# EAGLE schematic Esquemático_v4 (EAGLE 9.7.0)
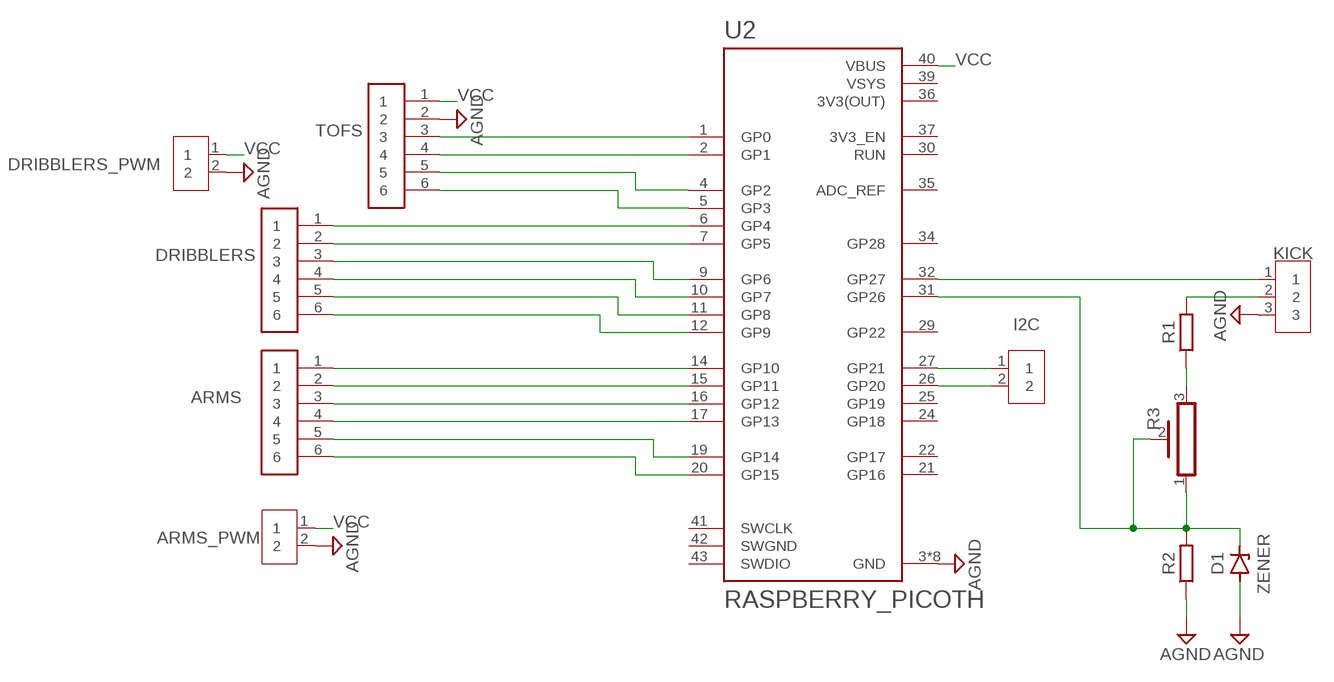
[diagram p0: schematic, sheet 1]

## Parts
ARMS  691311400106  [TERMINALBLOCK_PLUGGABLE-6-7.62MM]
ARMS_PWM  2828XX-2282834-2  [TERMBLK_254-2N]
D1  ZENER  ZENERDO-214AB(SMC)  [DIOM7959X625N]
DRIBBLERS  691311400106  [TERMINALBLOCK_PLUGGABLE-6-7.62MM]
DRIBBLERS_PWM  2828XX-2282834-2  [TERMBLK_254-2N]
I2C  2828XX-2282834-2  [TERMBLK_254-2N]
KICK  2828XX-3282837-3  [TERMBLK_508-3N]
R1  R_AXIAL-7.2MM-PITCH  [RESAD724W46L381D178B]
R2  R_AXIAL-7.2MM-PITCH  [RESAD724W46L381D178B]
R3  PV36Z  [PV36Z]
TOFS  691311400106  [TERMINALBLOCK_PLUGGABLE-6-7.62MM]
U2  RASPBERRY_PICOTH  [PICO-PKG-TH]

## Nets
AGND: ARMS_PWM.2 D1.2(A) DRIBBLERS_PWM.2 KICK.3 R2.1 TOFS.2 U2.3(GND) U2.8(GND) U2.13(GND) U2.18(GND) U2.23(GND) U2.28(GND) U2.33(GND) U2.38(GND)
KICK: TOFS.4 U2.2(GP1)
N$1: DRIBBLERS.1 U2.6(GP4)
N$2: TOFS.6 U2.5(GP3)
N$3: TOFS.5 U2.4(GP2)
N$4: DRIBBLERS.2 U2.7(GP5)
N$5: DRIBBLERS.3 U2.9(GP6)
N$6: DRIBBLERS.4 U2.10(GP7)
N$7: DRIBBLERS.5 U2.11(GP8)
N$8: DRIBBLERS.6 U2.12(GP9)
N$9: ARMS.1 U2.14(GP10)
N$10: ARMS.2 U2.15(GP11)
N$11: ARMS.3 U2.16(GP12)
N$12: ARMS.4 U2.17(GP13)
N$13: ARMS.5 U2.19(GP14)
N$14: ARMS.6 U2.20(GP15)
N$15: KICK.1 U2.32(GP27)
N$16: KICK.2 R1.2
N$17: D1.1(C) R2.2 R3.1 R3.2 U2.31(GP26)
N$18: I2C.1 U2.27(GP21)
N$19: I2C.2 U2.26(GP20)
N$20: R1.1 R3.3
N$21: U2.40(VBUS)
TOF_SDA: TOFS.3 U2.1(GP0)
VCC: ARMS_PWM.1 DRIBBLERS_PWM.1 TOFS.1
Unconnected: U2.21(GP16) U2.22(GP17) U2.24(GP18) U2.25(GP19) U2.29(GP22) U2.30(RUN) U2.34(GP28) U2.35(ADC_REF) U2.37(3V3_EN) U2.41(SWCLK) U2.43(SWDIO)

## Power pins joined to a net without a drawn wire
3V3(OUT): U2.36(3V3(OUT))
SWGND: U2.42(SWGND)
VSYS: U2.39(VSYS)

## Library data of the parts
ARMS DRIBBLERS TOFS = Terminal Blocks:691311400106: 7.62MM CLOSE VERTICAL PCB HEADER WR-TBL Manufacturer's datasheet <https://katalog.we-online.com/em/datasheet/6913114001xx.pdf>; CREATED_BY: PCBLayout.com; DIGIKEY_PART_NO: 732-2827-ND; MANUFACTURER: WURTH ELEKTRONIK; MPN: 691311400106
ARMS_PWM DRIBBLERS_PWM I2C = Connector:2828XX-2: 2 Position Wire to Board Terminal Block Horizontal with Board Datasheet <https://www.te.com.cn/commerce/DocumentDelivery/DDEController?Action=showdoc&DocId=Catalog+Section%7F1308389_EUROSTYLE_TERMINAL_BLOCKS%7F0607%7Fpdf%7FEnglish%7FENG_CS_1308389_EUROSTYLE_TERMINAL_BLOCKS_0607.pdf%7F2-282837-5>; CATEGORY: Fixed Terminal Blocks; DESCRIPTION: Fixed Terminal Blocks 2P SIDE ENTRY 2.54mm; MANUFACTURER: TE Connectivity AMP Connectors; MPN: 282834-2; OPERATING_TEMPERATURE: -40°C ~ 105°C; PART_STATUS: Active; PITCH: 0.100" (2.54mm); ROHS_COMPLIANCE: RoHS Compliant; SERIES: Buchanan; SUBCATEGORY: Terminal Blocks; TYPE: Through Hole; Screw - Rising Cage Clamp; Side wire entry, Horizontal with Board
D1 = Diode:ZENER: Zener Diode - Generic; CATEGORY: Diode; SUB-CATEGORY: Zener
KICK = Connector:2828XX-3: 3 Position Wire to Board Terminal Block Horizontal with Board Datasheet <https://www.te.com.cn/commerce/DocumentDelivery/DDEController?Action=showdoc&DocId=Catalog+Section%7F1308389_EUROSTYLE_TERMINAL_BLOCKS%7F0607%7Fpdf%7FEnglish%7FENG_CS_1308389_EUROSTYLE_TERMINAL_BLOCKS_0607.pdf%7F2-282837-5>; CATEGORY: Connector; DESCRIPTION: TERM BLK 3P SIDE ENT 5.08mm PCB; MANUFACTURER: TE Connectivity; MPN: 282837-3; OPERATING_TEMPERATURE: -40°C to +105°C; PART_STATUS: Active; PITCH: 0.200" (5.08mm); ROHS_COMPLIANCE: RoHS Compliant; SERIES: Buchanan; SUBCATEGORY: Terminal Block; TYPE: Side Wire Entry
R1 R2 = Resistor:R: Resistor Fixed - Generic; CATEGORY: Resistor; SUB-CATEGORY: Fixed
R3 = Resistor:PV36: Rectangular Trimmer Potentiometers - PV36 Series Datasheet <https://www.bourns.com/docs/Product-Datasheets/pv36.pdf>; CATEGORY: Resistor; DESCRIPTION: Lead Sealed Type Multiturn PV36 Series; MANUFACTURER: BOURNS; MPN: PV36Z; OPERATING_TEMPERATURE: -55 to +125 °C; PART_STATUS: Active; ROHS_COMPLIANCE: RoHS Compliant; SERIES: PV36; SUB-CATEGORY: Trimpot; TYPE: Lead Sealed
U2 = RpiPico:RASPBERRY_PICO: Raspberry Pi Pico